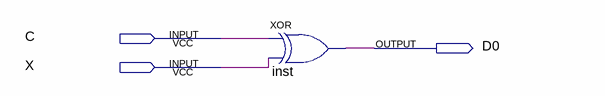
[diagram p0: schematic sheet]
// Quartus schematic F0.bdf as structural Verilog: 1 symbols, 3 pins
module F0 (
  input  C,
  input  X,
  output D0
);

  xor inst (D0, C, X);
endmodule
